# Altium schematic sheet Sensors.SchDoc
size A3
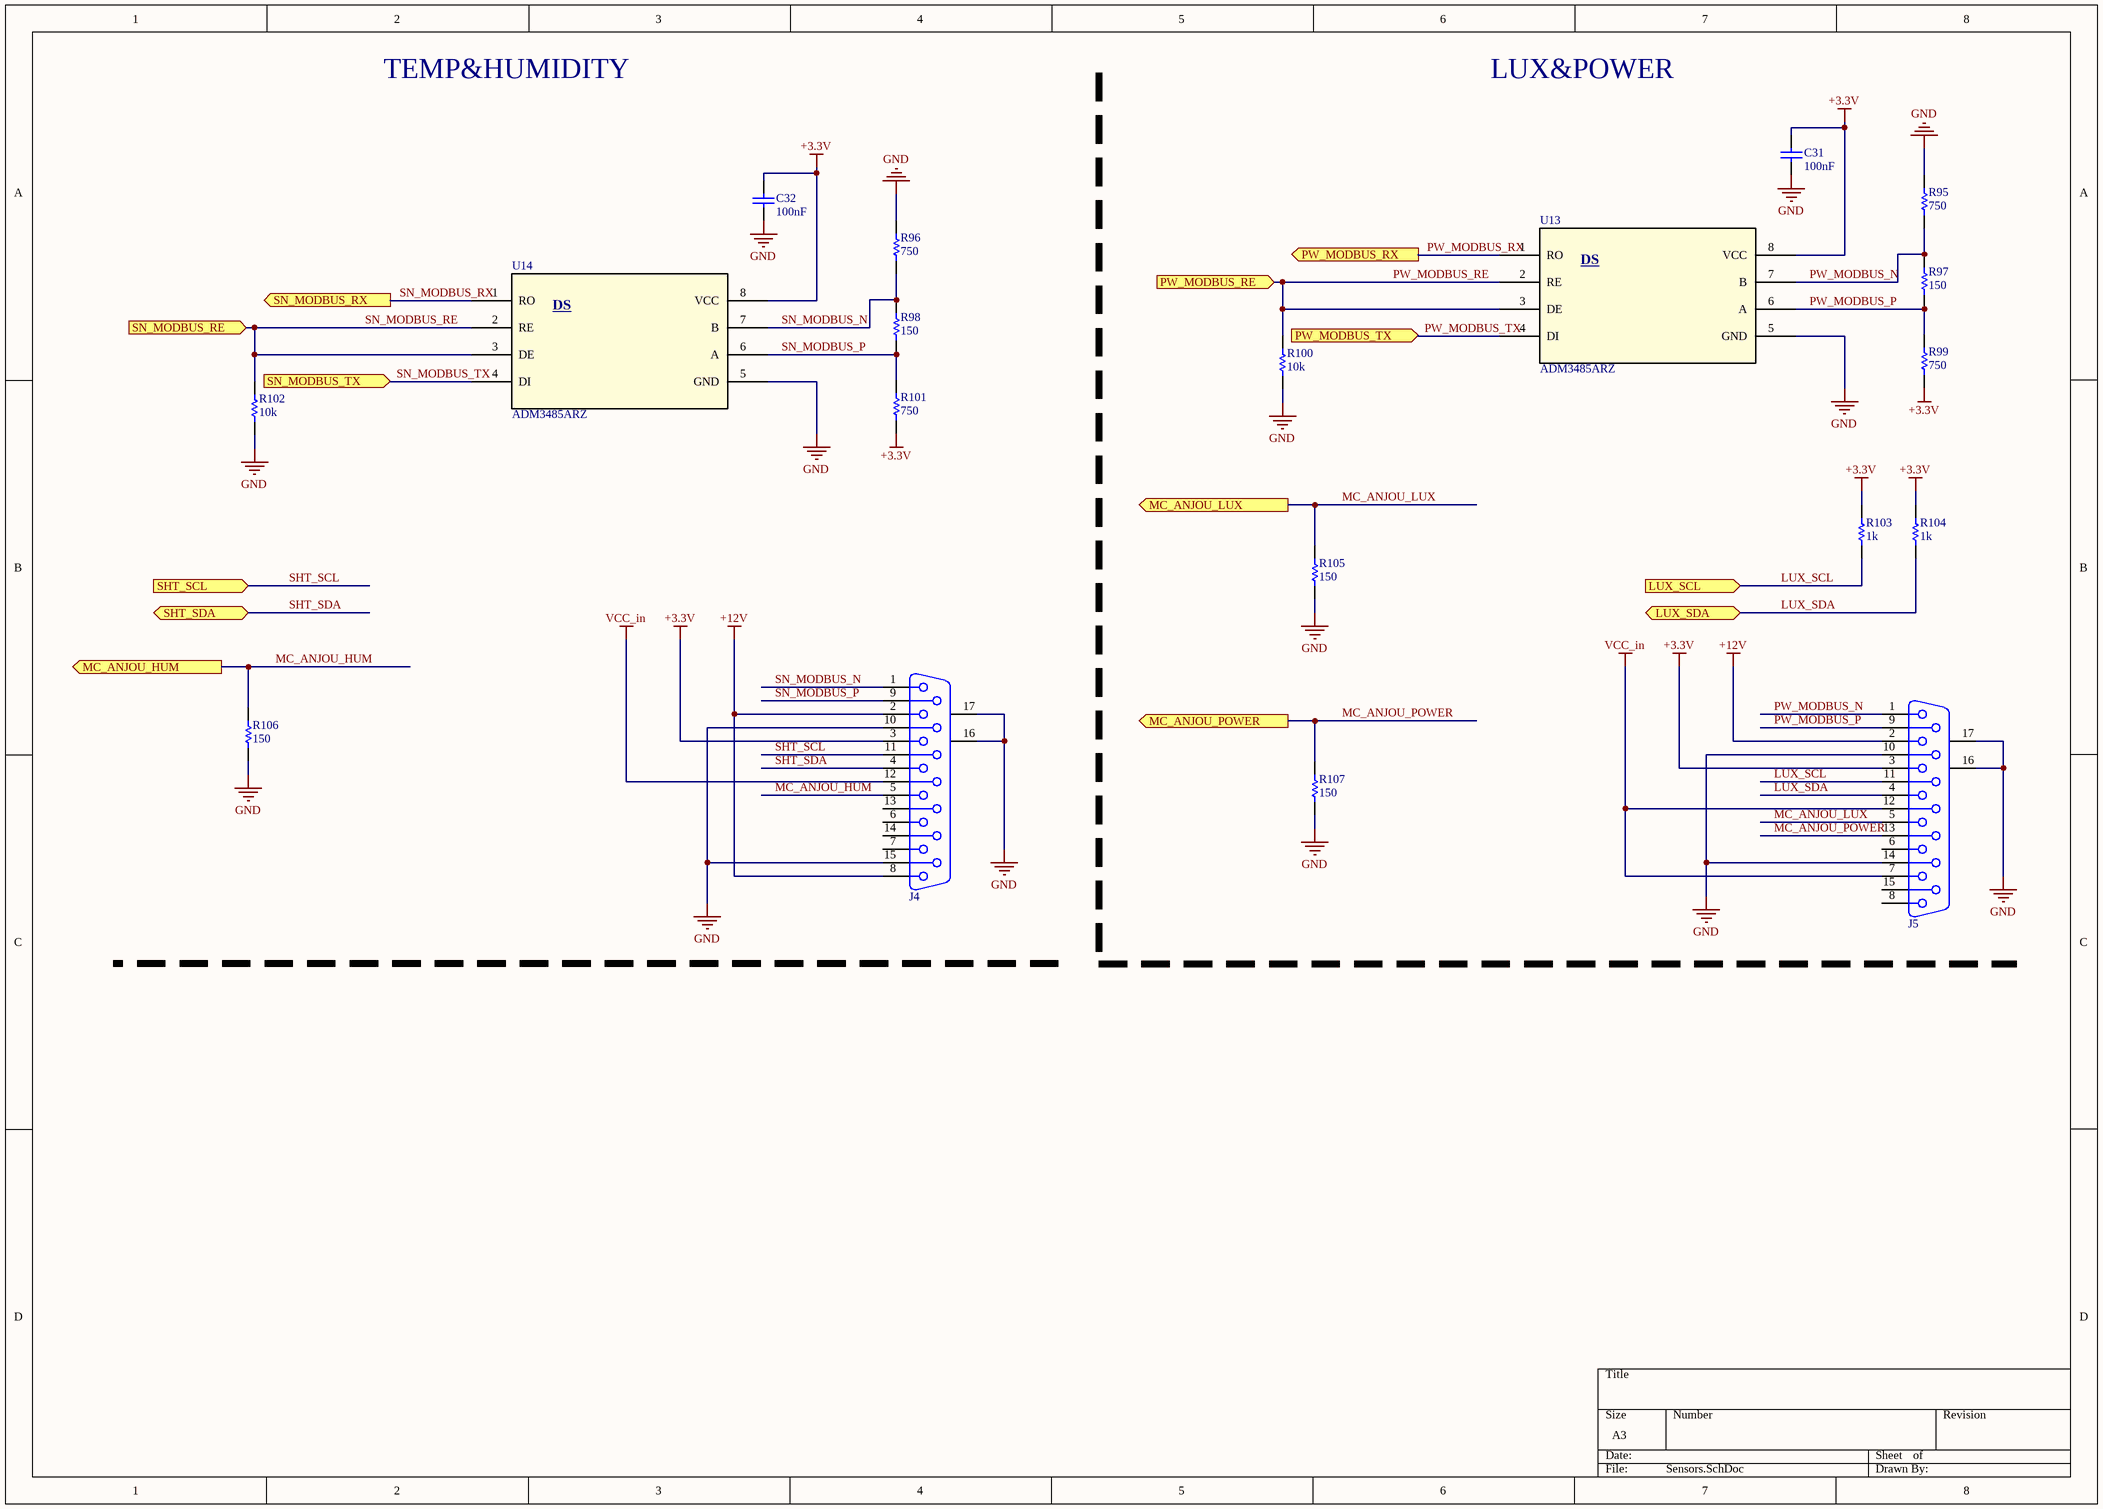
[diagram p0: Sensors.SchDoc]

## Parts
C31  value 100nF  [C-805]  (hidden comment: C-805)
C32  value 100nF  [C-805]  (hidden comment: C-805)
J4  DB15_Straight  [DB15_Straight]  (value not drawn)
J5  DB15_Straight  [DB15_Straight]  (value not drawn)
R95  value 750  [R-805]  (hidden comment: R-805)
R96  value 750  [R-805]  (hidden comment: R-805)
R97  value 150  [R-805]  (hidden comment: R-805)
R98  value 150  [R-805]  (hidden comment: R-805)
R99  value 750  [R-805]  (hidden comment: R-805)
R100  value 10k  [R-805]  (hidden comment: R-805)
R101  value 750  [R-805]  (hidden comment: R-805)
R102  value 10k  [R-805]  (hidden comment: R-805)
R103  value 1k  [R-805]  (hidden comment: R-805)
R104  value 1k  [R-805]  (hidden comment: R-805)
R105  value 150  [R-805]  (hidden comment: R-805)
R106  value 150  [R-805]  (hidden comment: R-805)
R107  value 150  [R-805]  (hidden comment: R-805)
U13  ADM3485ARZ  [R_8]
U14  ADM3485ARZ  [R_8]

## Ports
LUX_SCL (in), LUX_SDA (bidir), MC_ANJOU_HUM (out), MC_ANJOU_LUX (out), MC_ANJOU_POWER (out), PW_MODBUS_RE (in), PW_MODBUS_RX (out), PW_MODBUS_TX (in), SHT_SCL (in), SHT_SDA (bidir), SN_MODBUS_RE (in), SN_MODBUS_RX (out), SN_MODBUS_TX (in)

## Nets
+3.3V: C31.2 C32.2 J4.3 J5.3 R99.1 R101.1 R103.2 R104.2 U13.8(VCC) U14.8(VCC)
+12V: J4.2 J4.8 J5.2
GND: C31.1 C32.1 J4.10 J4.15 J4.16(MH1) J4.17(MH2) J5.10 J5.14 J5.16(MH1) J5.17(MH2) R95.2 R96.2 R100.1 R102.1 R105.1 R106.1 R107.1 U13.5(GND) U14.5(GND)
VCC_in: J4.12 J5.7 J5.12
LUX_SCL: J5.11 R103.1 ; port LUX_SCL
LUX_SDA: J5.4 R104.1 ; port LUX_SDA
MC_ANJOU_HUM: J4.5 R106.2 ; port MC_ANJOU_HUM
MC_ANJOU_LUX: J5.5 R105.2 ; port MC_ANJOU_LUX
MC_ANJOU_POWER: J5.13 R107.2 ; port MC_ANJOU_POWER
PW_MODBUS_N: J5.1 R95.1 R97.2 U13.7(B)
PW_MODBUS_P: J5.9 R97.1 R99.2 U13.6(A)
PW_MODBUS_RE: R100.2 U13.2(RE) U13.3(DE) ; port PW_MODBUS_RE
PW_MODBUS_RX: U13.1(RO) ; port PW_MODBUS_RX
PW_MODBUS_TX: U13.4(DI) ; port PW_MODBUS_TX
SHT_SCL: J4.11 ; port SHT_SCL
SHT_SDA: J4.4 ; port SHT_SDA
SN_MODBUS_N: J4.1 R96.1 R98.2 U14.7(B)
SN_MODBUS_P: J4.9 R98.1 R101.2 U14.6(A)
SN_MODBUS_RE: R102.2 U14.2(RE) U14.3(DE) ; port SN_MODBUS_RE
SN_MODBUS_RX: U14.1(RO) ; port SN_MODBUS_RX
SN_MODBUS_TX: U14.4(DI) ; port SN_MODBUS_TX

Not connected (* = marked no-connect by the designer): J4 6 7 13 14; J5 6 8 15

## Notes on the sheet
- TEMP&HUMIDITY
- LUX&POWER
- (in symbol ADM3485ARZ) DS

## Library data of the parts
C31 C32 = C-805: Capacitor; Published: 8-Jun-2000; LatestRevisionDate: 29-May-2009; LatestRevisionNote: IPC-7351 Footprint Added.; PackageReference: C1206; Publisher: Altium Limited; PackageDescription: Chip Capacitor
J4 J5 = DB15_Straight: Receptacle Assembly, 15 Position, Right Angle; PackageDocument: O; Positions: 15; Published: 15-Jun-2001; LatestRevisionDate: 17-Jul-2002; LatestRevisionNote: Re-released for DXP Platform.; DatasheetDocument: 1-Sep-99; PackageReference: 788757; Publisher: Altium Limited; Orientation: Right Angle; Gender: Receptacle
R95-R107 = R-805: Resistor
U13 U14 = ADM3485ARZ: No Description Available; Vendor: Analog Devices Inc; Built_By: EMA_UL_Team; Manufacturer_Part_Number: ADM3485ARZ; Copyright: Copyright (C) 2018 Accelerated Designs. All rights reserved; RefDes: RefDes; Type: DEV; Value: Value